# EAGLE design Perc_soundgen (EAGLE 7.1.0)
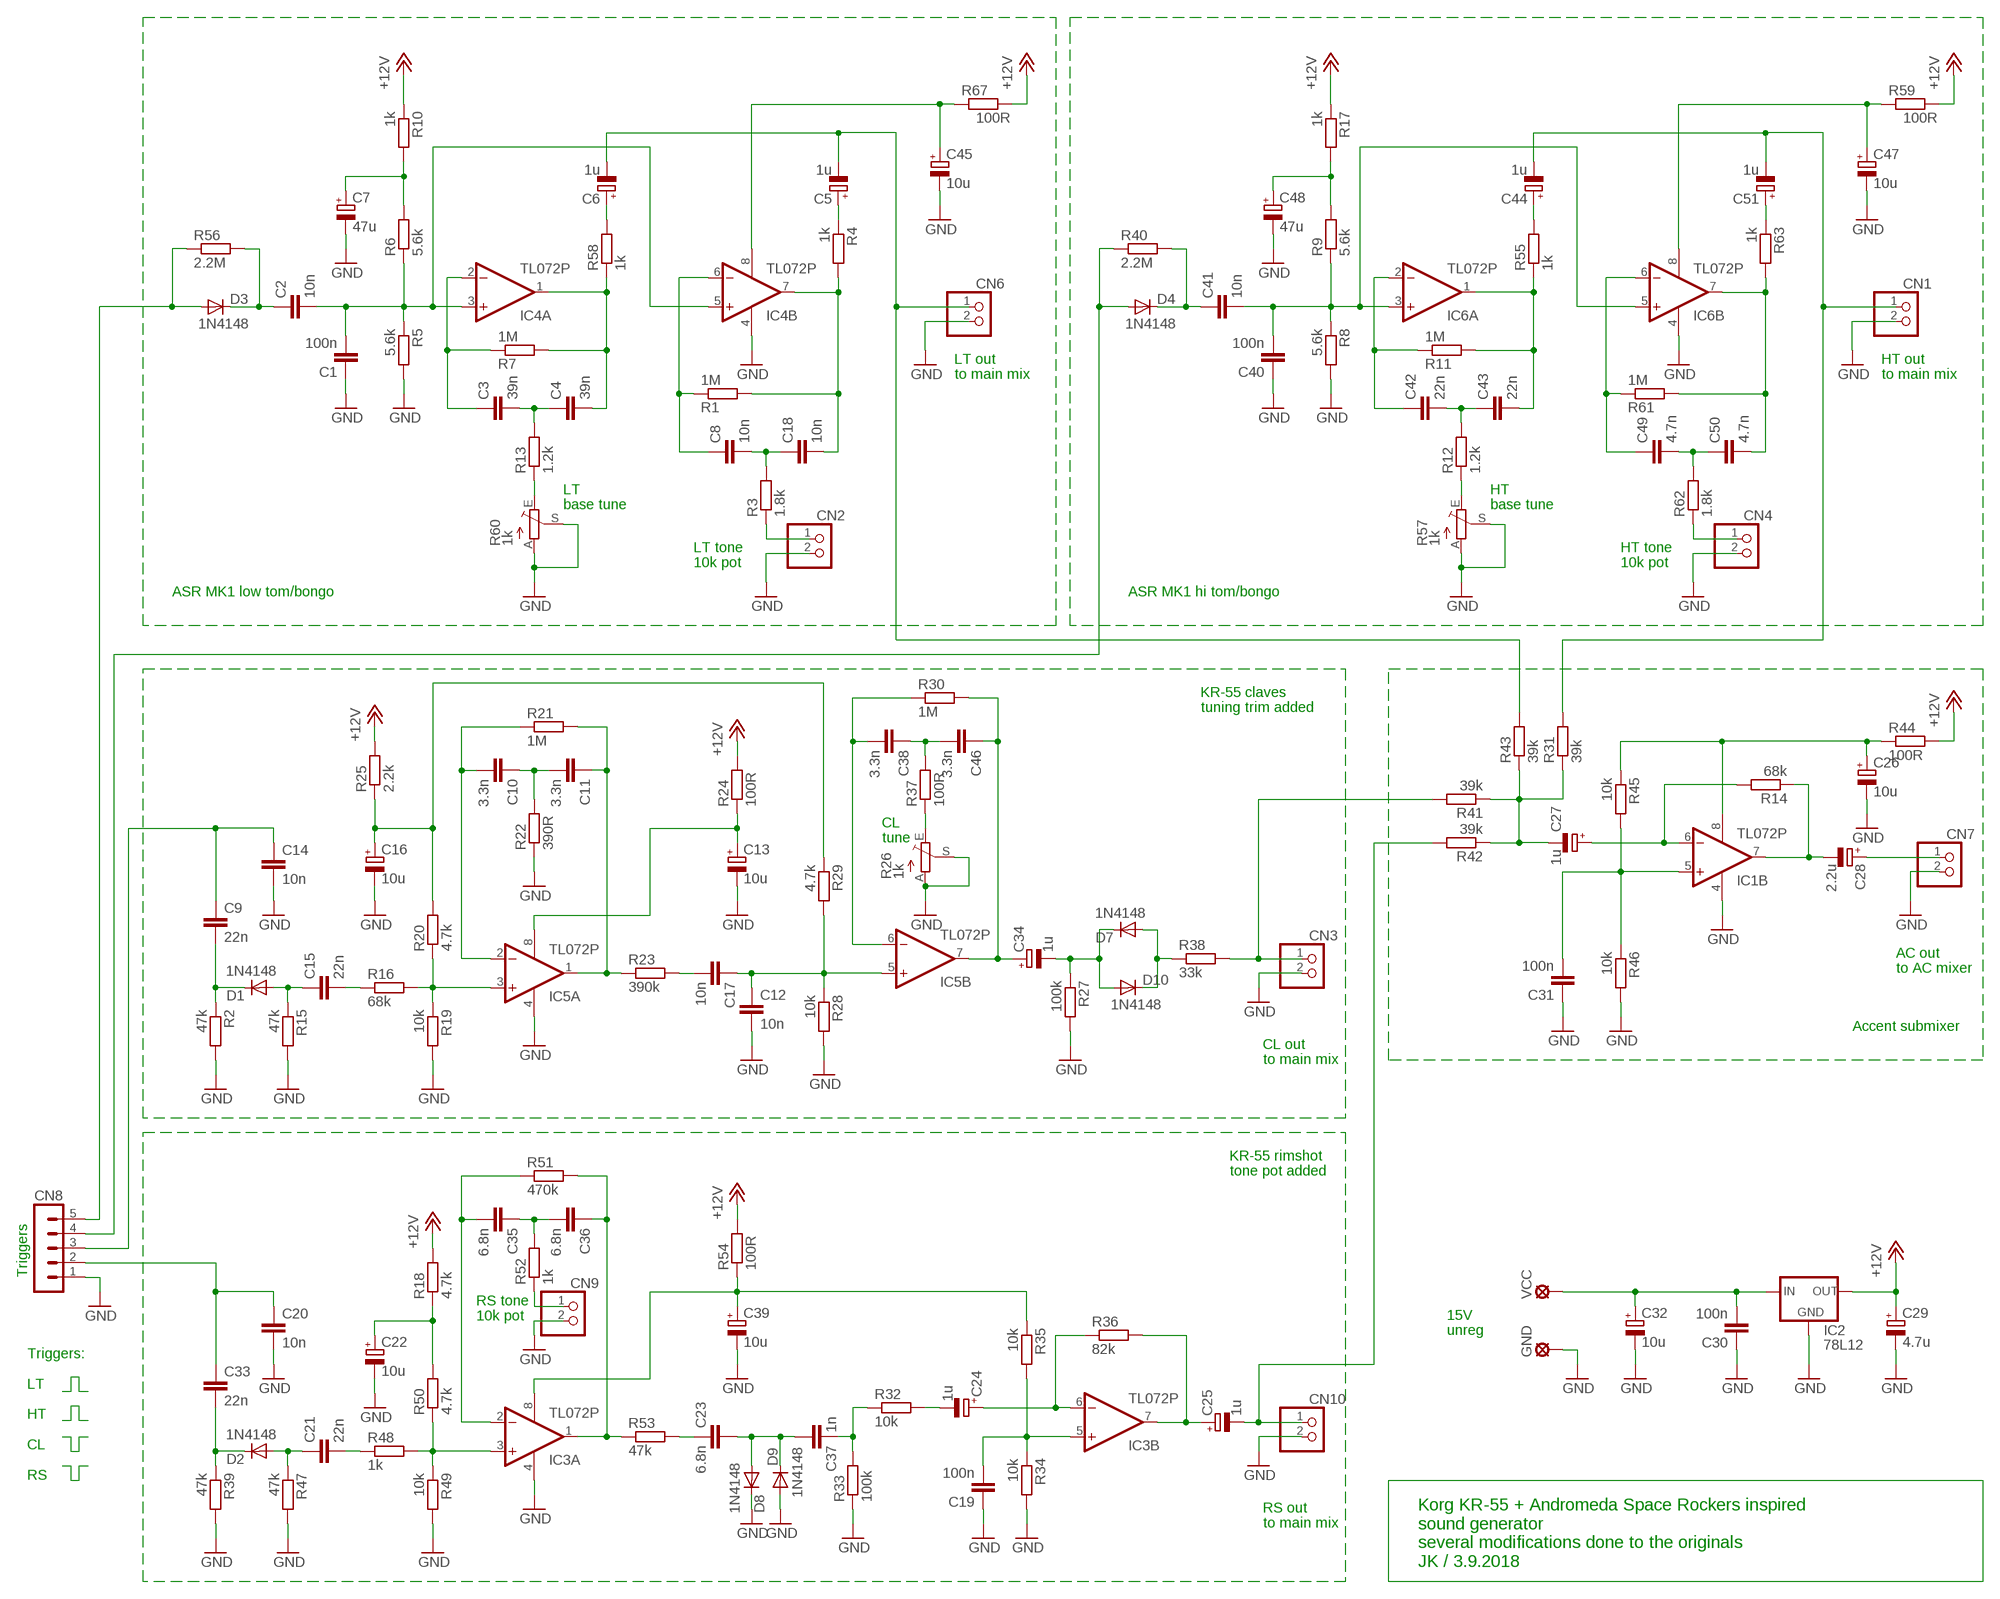
[diagram p0: schematic, sheet 1]

## Parts
C1  100n  C-EUC0805  [C0805]
C2  10n  C-EUC0603  [C0603]
C3  39n  C-EUC0805  [C0805]
C4  39n  C-EUC0805  [C0805]
C5  1u  CPOL-EUSMCA  [SMC_A]
C6  1u  CPOL-EUSMCA  [SMC_A]
C7  47u  CPOL-EUE2.5-5  [E2,5-5]
C8  10n  C-EUC0603  [C0603]
C9  22n  C-EUC0805  [C0805]
C10  3.3n  C-EUC0805  [C0805]
C11  3.3n  C-EUC0805  [C0805]
C12  10n  C-EUC0603  [C0603]
C13  10u  CPOL-EUE2.5-5  [E2,5-5]
C14  10n  C-EUC0603  [C0603]
C15  22n  C-EUC0805  [C0805]
C16  10u  CPOL-EUE2.5-5  [E2,5-5]
C17  10n  C-EUC0603  [C0603]
C18  10n  C-EUC0603  [C0603]
C19  100n  C-EUC0805  [C0805]
C20  10n  C-EUC0603  [C0603]
C21  22n  C-EUC0805  [C0805]
C22  10u  CPOL-EUE2.5-5  [E2,5-5]
C23  6.8n  C-EUC0805  [C0805]
C24  1u  CPOL-EUSMCA  [SMC_A]
C25  1u  CPOL-EUSMCA  [SMC_A]
C26  10u  CPOL-EUE2.5-5  [E2,5-5]
C27  1u  CPOL-EUSMCA  [SMC_A]
C28  2.2u  CPOL-EUSMCA  [SMC_A]
C29  4.7u  CPOL-EUSMCA  [SMC_A]
C30  100n  C-EUC0805  [C0805]
C31  100n  C-EUC0805  [C0805]
C32  10u  CPOL-EUE2.5-5  [E2,5-5]
C33  22n  C-EU075-032X103  [C075-032X103]
C34  1u  CPOL-EUSMCA  [SMC_A]
C35  6.8n  C-EUC0805  [C0805]
C36  6.8n  C-EUC0805  [C0805]
C37  1n  C-EUC0805  [C0805]
C38  3.3n  C-EUC0805  [C0805]
C39  10u  CPOL-EUE2.5-5  [E2,5-5]
C40  100n  C-EUC0805  [C0805]
C41  10n  C-EUC0603  [C0603]
C42  22n  C-EUC0805  [C0805]
C43  22n  C-EUC0805  [C0805]
C44  1u  CPOL-EUSMCA  [SMC_A]
C45  10u  CPOL-EUE2.5-5  [E2,5-5]
C46  3.3n  C-EUC0805  [C0805]
C47  10u  CPOL-EUE2.5-5  [E2,5-5]
C48  47u  CPOL-EUE2.5-5  [E2,5-5]
C49  4.7n  C-EUC0805  [C0805]
C50  4.7n  C-EUC0805  [C0805]
C51  1u  CPOL-EUSMCA  [SMC_A]
CN1  PINHD-1X2  [1X02]
CN2  PINHD-1X2  [1X02]
CN3  PINHD-1X2  [1X02]
CN4  PINHD-1X2  [1X02]
CN6  PINHD-1X2  [1X02]
CN7  PINHD-1X2  [1X02]
CN8  MA05-1  [MA05-1]
CN9  PINHD-1X2  [1X02]
CN10  PINHD-1X2  [1X02]
D1  1N4148  DIODE-SOD80C  [SOD80C]
D2  1N4148  DIODE-SOD80C  [SOD80C]
D3  1N4148  DIODE-SOD80C  [SOD80C]
D4  1N4148  DIODE-SOD80C  [SOD80C]
D7  1N4148  DIODE-SOD80C  [SOD80C]
D8  1N4148  DIODE-SOD80C  [SOD80C]
D9  1N4148  DIODE-SOD80C  [SOD80C]
D10  1N4148  DIODE-SOD80C  [SOD80C]
GND  LSP10  [LSP10]
IC1  TL072P  [DIL08]
IC2  78L12  78LXX  [78LXX]
IC3  TL072P  [DIL08]
IC4  TL072P  [DIL08]
IC5  TL072P  [DIL08]
IC6  TL072P  [DIL08]
R1  1M  R-EU_R0805  [R0805]
R2  47k  R-EU_R0805  [R0805]
R3  1.8k  R-EU_R0805  [R0805]
R4  1k  R-EU_0207/10  [0207/10]
R5  5.6k  R-EU_R0805  [R0805]
R6  5.6k  R-EU_R0805  [R0805]
R7  1M  R-EU_R0805  [R0805]
R8  5.6k  R-EU_R0805  [R0805]
R9  5.6k  R-EU_R0805  [R0805]
R10  1k  R-EU_R0805  [R0805]
R11  1M  R-EU_R0805  [R0805]
R12  1.2k  R-EU_R0805  [R0805]
R13  1.2k  R-EU_0207/12  [0207/12]
R14  68k  R-EU_R0805  [R0805]
R15  47k  R-EU_R0805  [R0805]
R16  68k  R-EU_R0805  [R0805]
R17  1k  R-EU_R0805  [R0805]
R18  4.7k  R-EU_0207/10  [0207/10]
R19  10k  R-EU_R0805  [R0805]
R20  4.7k  R-EU_R0805  [R0805]
R21  1M  R-EU_R0805  [R0805]
R22  390R  R-EU_R1206  [R1206]
R23  390k  R-EU_0207/10  [0207/10]
R24  100R  R-EU_R0805  [R0805]
R25  2.2k  R-EU_R0805  [R0805]
R26  1k  TRIM_EU-S63X  [S63X]
R27  100k  R-EU_R0805  [R0805]
R28  10k  R-EU_R0805  [R0805]
R29  4.7k  R-EU_0207/10  [0207/10]
R30  1M  R-EU_R0805  [R0805]
R31  39k  R-EU_R0805  [R0805]
R32  10k  R-EU_R0805  [R0805]
R33  100k  R-EU_R0805  [R0805]
R34  10k  R-EU_R0805  [R0805]
R35  10k  R-EU_R0805  [R0805]
R36  82k  R-EU_R0805  [R0805]
R37  100R  R-EU_R0805  [R0805]
R38  33k  R-EU_R0805  [R0805]
R39  47k  R-EU_R0805  [R0805]
R40  2.2M  R-EU_R0805  [R0805]
R41  39k  R-EU_R0805  [R0805]
R42  39k  R-EU_R0805  [R0805]
R43  39k  R-EU_R0805  [R0805]
R44  100R  R-EU_R0805  [R0805]
R45  10k  R-EU_R0805  [R0805]
R46  10k  R-EU_R0805  [R0805]
R47  47k  R-EU_R0805  [R0805]
R48  1k  R-EU_R0805  [R0805]
R49  10k  R-EU_R0805  [R0805]
R50  4.7k  R-EU_R0805  [R0805]
R51  470k  R-EU_R0805  [R0805]
R52  1k  R-EU_R0805  [R0805]
R53  47k  R-EU_0207/10  [0207/10]
R54  100R  R-EU_R0805  [R0805]
R55  1k  R-EU_0207/10  [0207/10]
R56  2.2M  R-EU_R0805  [R0805]
R57  1k  TRIM_EU-S63X  [S63X]
R58  1k  R-EU_0207/10  [0207/10]
R59  100R  R-EU_R0805  [R0805]
R60  1k  TRIM_EU-S63X  [S63X]
R61  1M  R-EU_R0805  [R0805]
R62  1.8k  R-EU_R0805  [R0805]
R63  1k  R-EU_0207/10  [0207/10]
R67  100R  R-EU_R0805  [R0805]
VCC  LSP10  [LSP10]

## Nets
+12V: C29.+ IC2.OUT R10.1 R17.1 R18.2 R24.2 R25.2 R44.2 R54.2 R59.2 R67.2
+15V: C30.2 C32.+ IC2.IN VCC.MP
GND: C1.1 C7.- C12.2 C13.- C14.2 C16.- C19.1 C20.2 C22.- C26.- C29.- C30.1 C31.1 C32.- C39.- C40.1 C45.- C47.- C48.- CN1.2 CN2.2 CN3.2 CN4.2 CN6.2 CN7.2 CN8.1 CN9.2 CN10.2 D8.C D9.A GND.MP IC1.4(P:V-) IC2.GND IC3.4(P:V-) IC4.4(P:V-) IC5.4(P:V-) IC6.4(P:V-) R2.2 R5.2 R8.2 R15.2 R19.2 R22.1 R26.A R26.S R27.2 R28.2 R33.1 R34.2 R39.2 R46.2 R47.2 R49.2 R57.A R57.S R60.A R60.S
N$2: C3.1 IC4.2(A:-IN) R7.1
N$3: C4.2 IC4.1(A:OUT) R7.2 R58.1
N$4: C1.2 C2.2 IC4.3(A:+IN) IC4.5(B:+IN) R5.1 R6.1
N$5: C6.+ R58.2
N$6: C7.+ R6.2 R10.2
N$7: C18.2 IC4.7(B:OUT) R1.2 R4.2
N$9: R13.1 R60.E
N$10: C10.2 IC5.2(A:-IN) R21.1
N$11: C2.1 D3.C R56.2
N$12: C23.2 R53.2
N$13: CN2.1 R3.1
N$14: C11.1 IC5.1(A:OUT) R21.2 R23.1
N$15: C10.1 C11.2 R22.2
N$17: R26.E R37.1
N$18: IC5.3(A:+IN) R16.2 R19.1 R20.1
N$19: C15.2 R16.1
N$20: C15.1 D1.A R15.1
N$21: C9.2 D1.C R2.1
N$23: C16.+ R20.2 R25.1 R29.1
N$24: C38.2 IC5.6(B:-IN) R30.1
N$25: C8.1 IC4.6(B:-IN) R1.1
N$26: C35.2 IC3.2(A:-IN) R51.1
N$27: C12.1 C17.1 IC5.5(B:+IN) R28.1 R29.2
N$28: C34.- D7.C D10.A R27.1
N$29: C34.+ C46.1 IC5.7(B:OUT) R30.2
N$30: C8.2 C18.1 R3.2
N$31: C17.2 R23.2
N$34: C24.+ IC3.6(B:-IN) R36.1
N$36: C22.+ R18.1 R50.2
N$37: C24.- R32.2
N$38: C19.2 IC3.5(B:+IN) R34.1 R35.2
N$39: D7.A D10.C R38.1
N$40: C37.1 R32.1 R33.2
N$41: C27.- R31.1 R41.1 R42.1 R43.1
N$42: C28.- IC1.7(B:OUT) R14.1
N$43: C27.+ IC1.6(B:-IN) R14.2
N$45: C23.1 C37.2 D8.A D9.C
N$50: C36.1 IC3.1(A:OUT) R51.2 R53.1
N$51: C35.1 C36.2 R52.2
N$52: CN9.1 R52.1
N$53: IC3.3(A:+IN) R48.2 R49.1 R50.1
N$54: C21.2 R48.1
N$55: C21.1 D2.A R47.1
N$56: C33.2 D2.C R39.1
N$57: C38.1 C46.2 R37.2
N$58: C25.+ IC3.7(B:OUT) R36.2
N$59: C3.2 C4.1 R13.2
N$60: C5.+ R4.1
N$61: C43.2 IC6.1(A:OUT) R11.2 R55.1
N$62: C40.2 C41.2 IC6.3(A:+IN) IC6.5(B:+IN) R8.1 R9.1
N$63: C42.1 IC6.2(A:-IN) R11.1
N$64: C42.2 C43.1 R12.2
N$65: C47.+ IC6.8(P:V+) R59.1
N$66: C48.+ R9.2 R17.2
N$67: C41.1 D4.C R40.2
N$69: C50.2 IC6.7(B:OUT) R61.2 R63.2
N$70: CN4.1 R62.1
N$71: C49.1 IC6.6(B:-IN) R61.1
N$72: C49.2 C50.1 R62.2
N$73: R12.1 R57.E
N$74: C45.+ IC4.8(P:V+) R67.1
N$75: C44.+ R55.2
N$76: C51.+ R63.1
OUT_AC: C28.+ CN7.1
OUT_CL: CN3.1 R38.2 R41.2
OUT_HT: C44.- C51.- CN1.1 R31.2
OUT_LT: C5.- C6.- CN6.1 R43.2
OUT_RS: C25.- CN10.1 R42.2
TRIG_CL: C9.1 C14.1 CN8.3
TRIG_HT: CN8.4 D4.A R40.1
TRIG_LT: CN8.5 D3.A R56.1
TRIG_RS: C20.1 C33.1 CN8.2
V_BD: C39.+ IC3.8(P:V+) R35.1 R54.1
V_BD1: C13.+ IC5.8(P:V+) R24.1
V_MX: C26.+ IC1.8(P:V+) R44.1 R45.1
V_MX/2: C31.2 IC1.5(B:+IN) R45.2 R46.1
Unconnected: IC1.1(A:OUT) IC1.2(A:-IN) IC1.3(A:+IN)

## Notes on the sheet
- LT out
  to main mix
- HT out
  to main mix
- LT
  base tune
- HT
  base tune
- LT tone
  10k pot
- HT tone
  10k pot
- ASR MK1 low tom/bongo | ASR MK1 hi tom/bongo
- KR-55 claves
  tuning trim added
- CL
  tune
- AC out
  to AC mixer
- Accent submixer
- CL out
  to main mix
- KR-55 rimshot
  tone pot added
- Triggers
- RS tone
  10k pot
- 15V
  unreg
- Triggers:
  
  LT
  
  HT
  
  CL
  
  RS
- RS out
  to main mix
- Korg KR-55 + Andromeda Space Rockers inspired
  sound generator
  several modifications done to the originals
  JK / 3.9.2018

## Library data of the parts
C1-C4 C8-C12 C14 C15 C17-C21 C23 C30 C31 C33 C35-C38 C40-C43 C46 C49 C50 = rcl:C-EU: CAPACITOR, European symbol
C5-C7 C13 C16 C22 C24-C29 C32 C34 C39 C44 C45 C47 C48 C51 = rcl:CPOL-EU: POLARIZED CAPACITOR, European symbol
CN1-CN4 CN6 CN7 CN9 CN10 = pinhead:PINHD-1X2: PIN HEADER
CN8 = con-lstb:MA05-1: PIN HEADER; OC_FARNELL: unknown; OC_NEWARK: unknown
D1-D4 D7-D10 = diode:DIODE-: DIODE
GND VCC = solpad:LSP10: SOLDER PAD drill 1.0 mm, distributor Buerklin, 12H555
IC1 IC3-IC6 = linear:TL072: OP AMP
IC2 = v-reg:78LXX: VOLTAGE REGULATOR
R1-R25 R27-R56 R58 R59 R61-R63 R67 = rcl:R-EU_: RESISTOR, European symbol
R26 R57 R60 = pot:TRIM_EU-: POTENTIOMETER

## Board
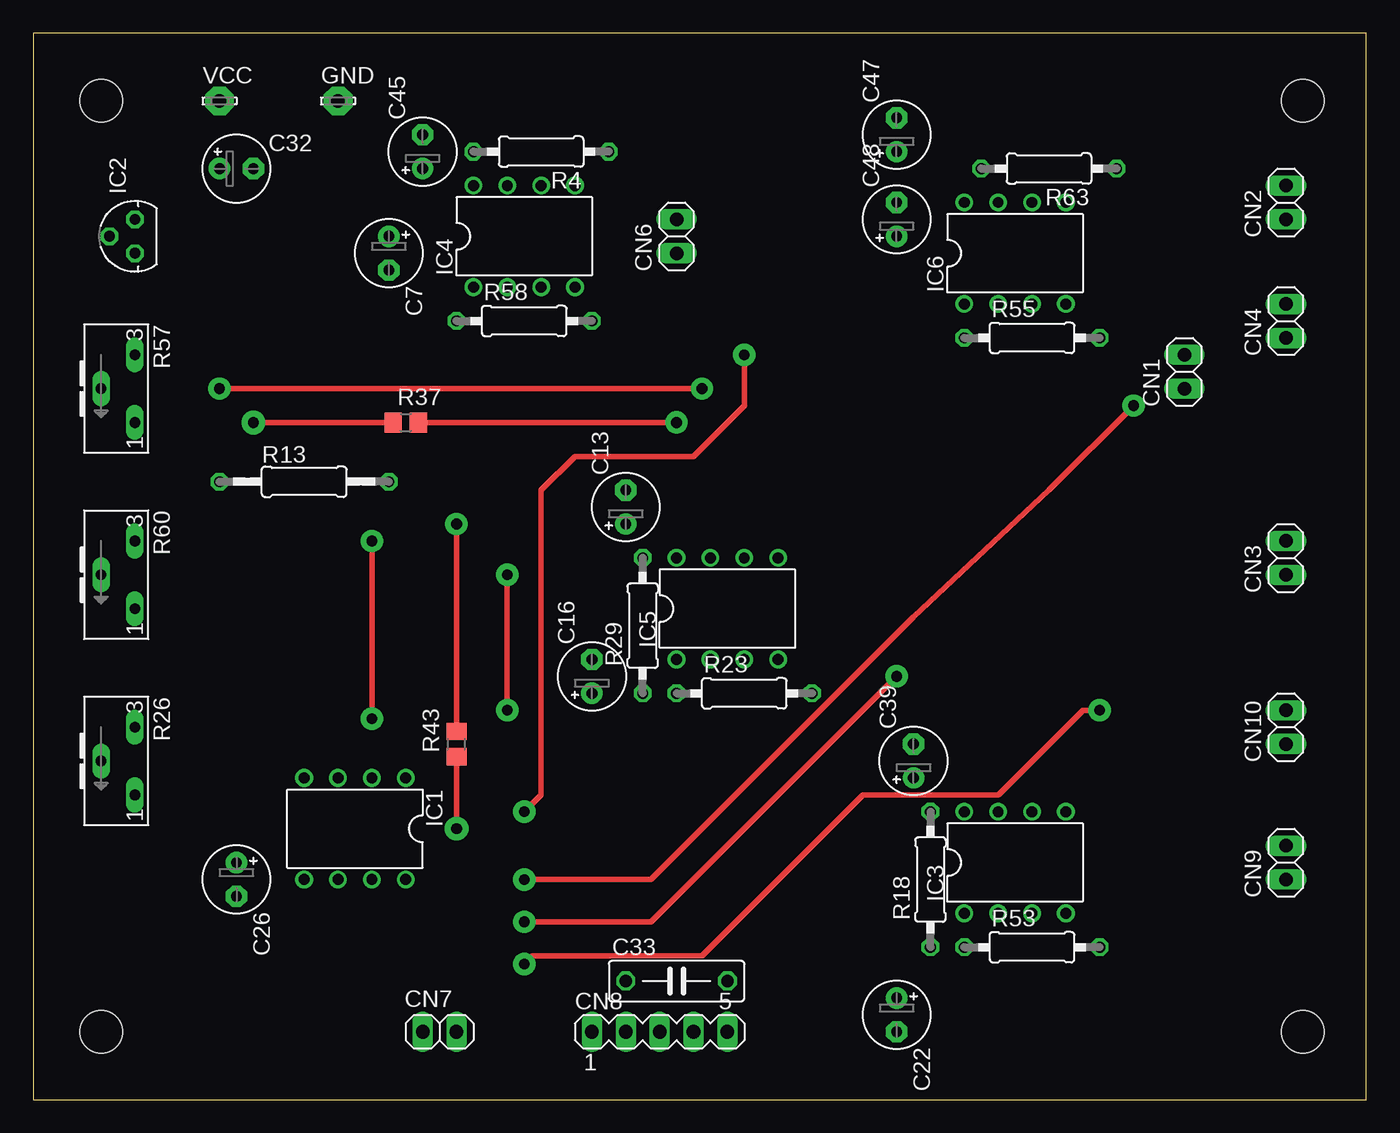
[diagram p1: board, top side]
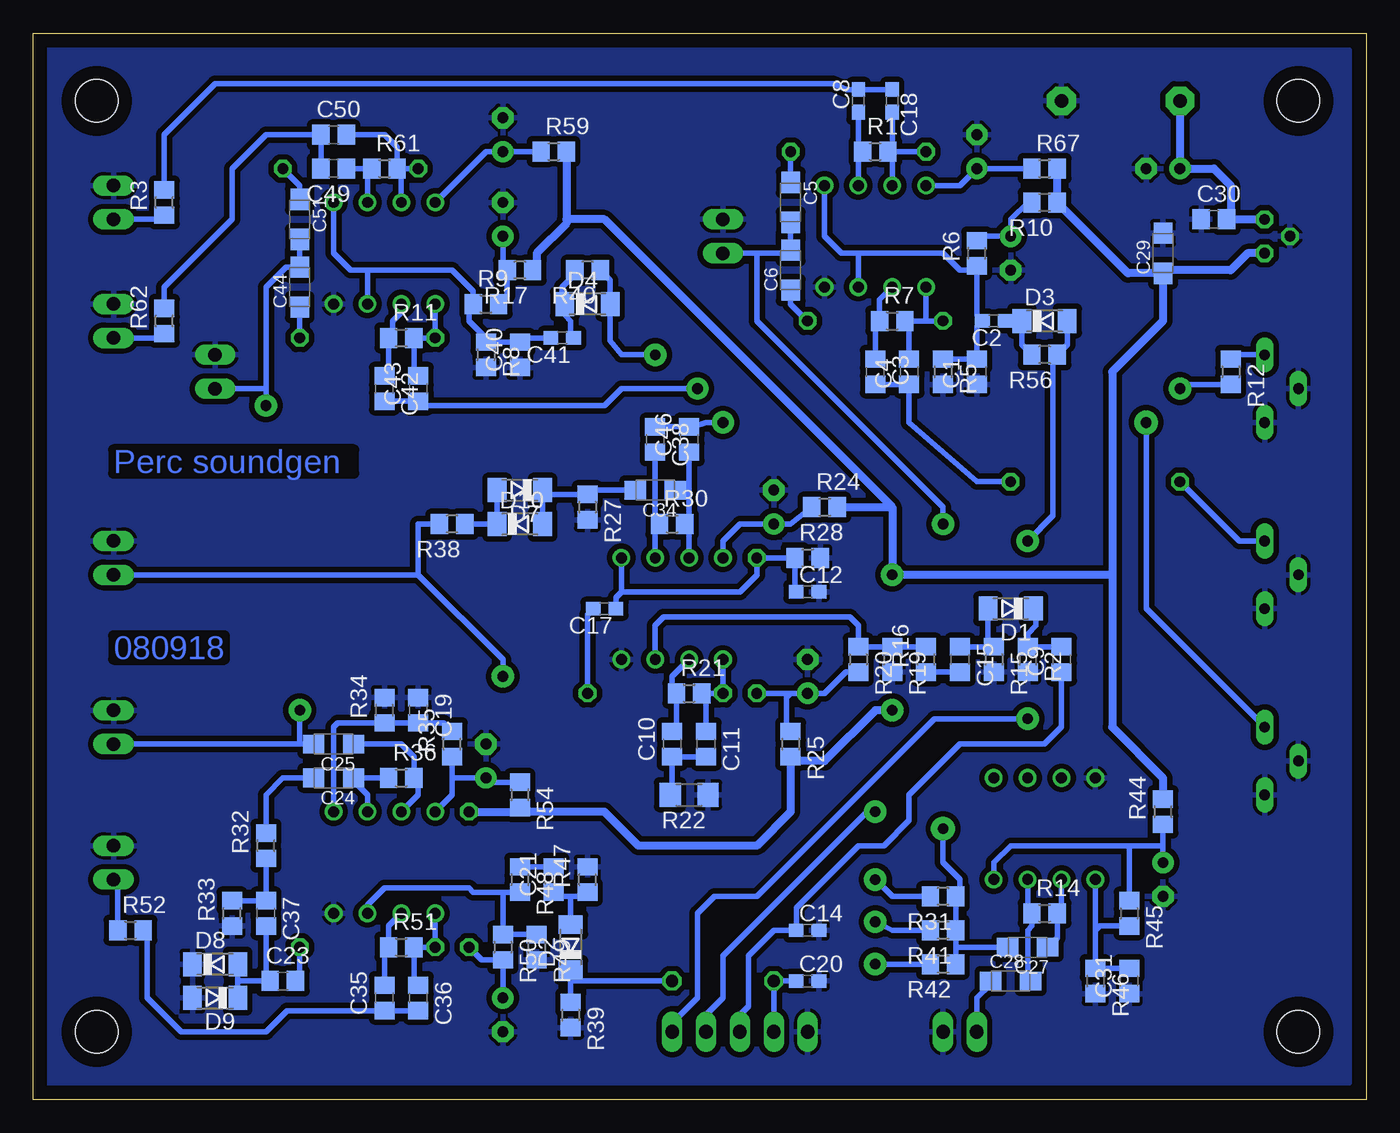
[diagram p2: board, bottom side, seen from below]

Size 100 x 80 mm. Coordinates in mm from the lower left corner, seen from the top.
Outline: 0,0 100,0 100,80 0,80 0,0
Copper layers (1*16): Top 0.035mm / dielectric 1.5mm / Bottom 0.035mm
Design rules "default": minimum track width 10mil, minimum drill 24mil, track to track 8mil, track to pad 8mil, pad to pad 8mil, via to via 8mil, smd to smd 8mil, copper to edge 40mil, drill to drill 8mil, minimum pad ring 10mil, minimum via ring 8mil, stop-mask expansion 4mil, vias tented up to drill 0mil, thermal gap 10mil
Holes 3.2 mm at 5.08,74.93 95.25,74.93 5.08,5.08 95.25,5.08

### Footprints (pad centres in the part's own frame; a part is rotated, then mirrored left to right if it is on the bottom)
C0805 = smd 1.3 x 1.5: 1 -0.95,0; 2 0.95,0
C0603 = smd 1.1 x 1: 1 -0.85,0; 2 0.85,0
SMC_A = smd 1.6 x 1.4: + -1.5,0; - 1.5,0
E2,5-5 = drill 0.813 pad 1.6: + -1.27,0 | drill 0.813 pad 1.6 octagon: - 1.27,0
C075-032X103 = drill 0.914 octagon: 1 -3.81,0; 2 3.81,0
1X02 = drill 1.016 long: 1 -1.27,0; 2 1.27,0
MA05-1 = drill 1.016 long: 1 -5.08,0; 2 -2.54,0; 3 0,0; 4 2.54,0; 5 5.08,0
SOD80C = smd 1.4 x 1.8: A 1.7,0; C -1.7,0
LSP10 = drill 1.016 pad 2.159 octagon: MP 0,0
DIL08 = drill 0.813 pad 1.27: 1 -3.81,-3.81; 2 -1.27,-3.81; 3 1.27,-3.81; 4 3.81,-3.81; 5 3.81,3.81; 6 1.27,3.81; 7 -1.27,3.81; 8 -3.81,3.81
78LXX = drill 0.813 octagon: GND 0,1.905; IN 1.27,0; OUT -1.27,0
R0805 = smd 1.3 x 1.5: 1 -0.95,0; 2 0.95,0
0207/10 = drill 0.813 octagon: 1 -5.08,0; 2 5.08,0
0207/12 = drill 0.813 octagon: 1 -6.35,0; 2 6.35,0
R1206 = smd 1.6 x 1.803: 1 -1.422,0; 2 1.422,0
S63X = drill 0.813 long: A 2.54,0; E -2.54,0; S 0,-2.54

### Placement (x,y rotation side)
C1  29.21,54.61 90 bottom
C2  27.94,58.42 180 bottom
C3  36.83,54.61 270 bottom
C4  34.29,54.61 90 bottom
C5  43.18,67.31 270 bottom
C6  43.18,62.23 90 bottom
C7  26.67,63.5 270 top
C8  38.1,74.93 90 bottom
C9  22.86,33.02 90 bottom
C10  52.07,26.67 90 bottom
C11  49.53,26.67 270 bottom
C12  41.91,38.1 0 bottom
C13  44.45,44.45 90 top
C14  41.91,12.7 0 bottom
C15  30.48,33.02 270 bottom
C16  41.91,31.75 90 top
C17  57.15,36.83 180 bottom
C18  35.56,74.93 270 bottom
C19  71.12,29.21 270 bottom
C20  41.91,8.89 0 bottom
C21  60.96,16.51 90 bottom
C22  64.77,6.35 270 top
C23  81.28,8.89 0 bottom
C24  77.47,24.13 180 bottom
C25  77.47,26.67 180 bottom
C26  15.24,16.51 270 top
C27  25.4,11.43 180 bottom
C28  26.67,8.89 0 bottom
C29  15.24,63.5 90 bottom
C30  11.43,66.04 0 bottom
C31  17.78,8.89 90 bottom
C32  15.24,69.85 0 top
C33  48.26,8.89 0 top
C34  53.34,45.72 180 bottom
C35  73.66,7.62 90 bottom
C36  71.12,7.62 270 bottom
C37  82.55,13.97 270 bottom
C38  53.34,49.53 270 bottom
C39  66.04,25.4 90 top
C40  63.5,55.88 90 bottom
C41  60.33,57.15 180 bottom
C42  73.66,53.34 270 bottom
C43  71.12,53.34 90 bottom
C44  80.01,60.96 90 bottom
C45  29.21,71.12 90 top
C46  50.8,49.53 90 bottom
C47  64.77,72.39 90 top
C48  64.77,66.04 90 top
C49  77.47,69.85 180 bottom
C50  77.47,72.39 0 bottom
C51  80.01,66.04 270 bottom
CN1  86.36,54.61 90 top
CN2  93.98,67.31 90 top
CN3  93.98,40.64 90 top
CN4  93.98,58.42 90 top
CN6  48.26,64.77 90 top
CN7  30.48,5.08 0 top
CN8  46.99,5.08 0 top
CN9  93.98,17.78 90 top
CN10  93.98,27.94 90 top
D1  26.67,36.83 180 bottom
D2  59.69,11.43 90 bottom
D3  24.13,58.42 0 bottom
D4  58.42,59.69 0 bottom
D7  63.5,45.72 180 bottom
D8  86.36,10.16 0 bottom
D9  86.36,7.62 180 bottom
D10  63.5,43.18 0 bottom
GND  22.86,74.93 0 top
IC1  24.13,20.32 180 top
IC2  7.62,64.77 90 top
IC3  73.66,17.78 0 top
IC4  36.83,64.77 0 top
IC5  52.07,36.83 0 top
IC6  73.66,63.5 0 top
R1  36.83,71.12 0 bottom
R2  25.4,33.02 270 bottom
R3  90.17,67.31 90 bottom
R4  38.1,71.12 180 top
R5  31.75,54.61 270 bottom
R6  29.21,63.5 90 bottom
R7  35.56,58.42 0 bottom
R8  66.04,55.88 270 bottom
R9  66.04,59.69 0 bottom
R10  24.13,67.31 180 bottom
R11  72.39,57.15 0 bottom
R12  10.16,54.61 270 bottom
R13  20.32,46.35 0 top
R14  24.13,13.97 0 bottom
R15  27.94,33.02 270 bottom
R16  33.02,33.02 90 bottom
R17  63.5,62.23 180 bottom
R18  67.31,16.51 90 top
R19  35.56,33.02 270 bottom
R20  38.1,33.02 270 bottom
R21  50.8,30.48 0 bottom
R22  50.8,22.86 180 bottom
R23  53.34,30.48 0 top
R24  40.64,44.45 0 bottom
R25  43.18,26.67 270 bottom
R26  7.62,25.4 270 top
R27  58.42,44.45 270 bottom
R28  41.91,40.64 0 bottom
R29  45.72,35.56 90 top
R30  52.07,43.18 0 bottom
R31  31.75,15.24 180 bottom
R32  82.55,19.05 90 bottom
R33  85.09,13.97 90 bottom
R34  73.66,29.21 90 bottom
R35  68.58,26.67 90 bottom
R36  72.39,24.13 0 bottom
R37  27.94,50.8 0 top
R38  68.58,43.18 180 bottom
R39  59.69,6.35 270 bottom
R40  58.42,62.23 180 bottom
R41  31.75,12.7 180 bottom
R42  31.75,10.16 180 bottom
R43  31.75,26.67 90 top
R44  15.24,21.59 90 bottom
R45  17.78,13.97 270 bottom
R46  20.32,8.89 270 bottom
R47  58.42,16.51 90 bottom
R48  63.5,16.51 270 bottom
R49  62.23,11.43 270 bottom
R50  64.77,11.43 270 bottom
R51  72.39,11.43 0 bottom
R52  92.71,12.7 0 bottom
R53  74.93,11.43 0 top
R54  63.5,22.86 270 bottom
R55  74.93,57.15 0 top
R56  24.13,55.88 180 bottom
R57  7.62,53.34 270 top
R58  36.83,58.42 0 top
R59  60.96,71.12 0 bottom
R60  7.62,39.37 270 top
R61  73.66,69.85 0 bottom
R62  90.17,58.42 90 bottom
R63  76.2,69.85 180 top
R67  24.13,69.85 0 bottom
VCC  13.97,74.93 0 top

### Tracks (layer width: path | path; a pad name or v marks a point on that pad's centre or on a via)
+12V  (via drill 0.8 pad 1.68)
  Top 0.406: v35.56,39.37 v35.56,29.21
  Bottom 0.406: 63.82,21.59 R54.2
  Bottom 0.61: R18.2 63.82,21.59 | IC2.OUT 8.89,63.5 10.16,62.23 15.01,62.23 C29.+ | C29.+ 17.87,62 R10.1 R67.2 | C29.+ 15.24,58.42 19.05,54.61 19.05,39.37 | R59.2 60.01,66.04 | 60.01,66.04 60.01,65.72 62.23,63.5 62.23,62.55 R17.1 | 19.05,39.37 19.05,27.94 15.24,24.13 R44.2 | 35.56,44.45 v35.56,39.37 19.05,39.37 | v35.56,29.21 36.83,29.21 40.64,25.4 42.86,25.4 R25.2 43.18,21.59 45.72,19.05 54.61,19.05 57.15,21.59 63.18,21.59 R54.2 | R24.2 35.56,44.45 | 35.56,44.45 57.15,66.04 60.01,66.04
+15V
  Bottom 0.61: VCC.MP C32.+ 11.43,69.85 10.16,68.58 10.16,66.36 C30.2 IC2.IN
GND
  pour Bottom (isolate 0.406): 1.27,78.74 99.06,78.74 99.06,1.27 1.27,1.27
N$2
  Bottom 0.406: C3.1 36.83,58.1 R7.1 36.51,60.01 IC4.2
N$3
  Bottom 0.406: R58.1 33.02,58.42 | 33.02,58.42 R7.2 34.29,58.1 C4.2 | IC4.1 33.02,58.42
N$4
  Bottom 0.406: R5.1 C1.2 29.21,58 C2.2 29.21,58.84 29.21,62.23 | R6.1 29.21,62.23 | 29.21,62.23 30.48,62.23 31.75,63.5 38.1,63.5 | 38.1,63.5 39.37,63.5 40.64,64.77 IC4.5 | IC4.3 38.1,63.5
N$5
  Bottom 0.406: R58.2 43.18,59.69 C6.+
N$6
  Bottom 0.406: R10.2 25.4,67.31 26.67,66.04 C7.+ 28.89,64.77 R6.2
N$7
  Bottom 0.406: IC4.7 35.56,70.8 R1.2 | C18.2 35.56,71.44 R1.2 | R4.2 R1.2
N$9
  Bottom 0.406: R60.E 9.53,41.91 R13.1
N$10
  Bottom 0.406: IC5.2 52.07,31.75 52.07,30.8 R21.1 51.75,27.94 C10.2
N$11
  Bottom 0.406: R56.2 25.83,56.63 D3.C C2.1
N$12
  Bottom 0.406: R53.2 80.01,9.21 C23.2
N$13
  Bottom 0.406: CN2.1 90.49,66.04 R3.1
N$14
  Bottom 0.406: IC5.1 R23.1 R21.2 49.53,30.16 C11.1
N$15
  Bottom 0.406: C11.2 C10.1 52.07,23.01 R22.2
N$17  (via drill 0.8 pad 1.78)
  Top 0.406: R37.1 v16.51,50.8
  Bottom 0.406: v16.51,50.8 16.51,36.83 R26.E
N$18
  Bottom 0.406: R16.2 R19.1 R20.1 38.1,35.56 38.73,36.2 52.7,36.2 53.34,35.56 IC5.3
N$19
  Bottom 0.406: C15.2 R16.1
N$20
  Bottom 0.406: D1.A 28.37,34.4 R15.1 C15.1
N$21
  Bottom 0.406: C9.2 R2.1 25.4,34.92 24.77,35.56 24.77,36.62 D1.C
N$23
  Bottom 0.406: R20.2 39.05,32.07 40.64,30.48 C16.+ 43.18,30.48 | 43.18,30.48 R29.1 | 43.5,27.94 43.5,30.16 43.18,30.48
  Bottom 0.61: 43.5,27.94 R25.1
N$24
  Bottom 0.406: IC5.6 53.34,42.86 R30.1 53.34,43.5 C38.2 53.02,48.26
N$25
  Bottom 0.406: IC4.6 38.1,70.8 R1.1 38.1,71.44 C8.1
N$26
  Bottom 0.406: C35.2 73.66,11.11 R51.1 73.34,13.02 IC3.2
N$27
  Bottom 0.406: C12.1 42.86,38.2 R28.1 R29.2 45.72,39.37 46.99,38.1 55.88,38.1 | 55.88,38.1 IC5.5 | C17.1 56.3,37.68 55.88,38.1
N$28
  Bottom 0.406: 58.33,45.49 R27.1 | R27.1 61.48,45.4 D7.C D10.A | C34.- 58.1,45.72 R27.1
N$29
  Bottom 0.406: IC5.7 50.8,42.86 R30.2 50.8,43.5 50.8,45.72 | 51.84,45.95 C34.+ 50.8,45.72 | C46.1 50.8,45.72
N$30
  Bottom 0.406: C18.1 C8.2 38.95,75.78 40.01,76.2 86.36,76.2 90.17,72.39 R3.2
N$31
  Bottom 0.406: R23.2 58.42,36.41 C17.2
N$34
  Bottom 0.406: R36.1 C24.+ 75.97,23.9 74.93,22.86 IC3.6
N$36
  Bottom 0.406: C22.+ R50.2 66.36,10.48 R18.1
N$37
  Bottom 0.406: R32.2 82.55,22.86 81.28,24.13 C24.-
N$38
  Bottom 0.406: R35.2 69.21,28.25 C19.2 R34.1 77.15,28.26 77.47,27.94 IC3.5
N$39
  Bottom 0.406: D7.A D10.C R38.1
N$40
  Bottom 0.406: R33.2 C37.1 R32.1
N$41  (via drill 0.8 pad 1.78)
  Top 0.406: R43.1 v31.75,20.32
  Bottom 0.406: R42.1 30.8,11.43 | 30.8,11.43 R41.1 R31.1 30.48,15.56 30.48,16.51 31.75,17.78 v31.75,20.32 | C27.- 30.8,11.43
N$42
  Bottom 0.406: IC1.7 25.4,14.29 R14.1 25.08,13.02 25.4,12.7 25.4,9.12 C28.-
N$43
  Bottom 0.406: IC1.6 22.86,14.29 R14.2 23.18,12.15 C27.+
N$45
  Bottom 0.406: D9.C 84.66,8.89 | 84.66,8.89 D8.A | 84.66,8.89 C23.1 82.55,9.21 C37.2
N$50
  Bottom 0.406: IC3.1 R53.1 R51.2 71.44,8.89 C36.1
N$51
  Bottom 0.406: C36.2 C35.1 80.96,6.67 82.55,5.08 88.9,5.08 91.44,7.62 91.44,12.38 R52.2
N$52
  Bottom 0.406: R52.1 93.66,16.19 CN9.1
N$53
  Bottom 0.406: R49.1 R50.1 64.77,15.56 | R48.2 64.77,15.56 | 64.77,15.56 67,15.56 67.31,15.88 73.66,15.88 74.93,14.61 IC3.3
N$54
  Bottom 0.406: C21.2 R48.1
N$55
  Bottom 0.406: 59.69,15.24 D2.A 59.69,12.7 | 59.69,15.24 58.42,15.24 R47.1 | 59.69,15.24 60.96,15.24 C21.1
N$56
  Bottom 0.406: C33.2 59.69,8.89 | 59.69,8.89 R39.1 | 59.69,8.89 D2.C 59.69,10.16
N$57  (via drill 0.8 pad 1.68)
  Top 0.406: v48.26,50.8 R37.2
  Bottom 0.406: C38.1 C46.2 50.48,50.48 49.53,50.8 v48.26,50.8
N$58
  Bottom 0.406: IC3.7 71.12,22.86 71.12,23.81 R36.2 71.44,25.72 72.39,26.67 C25.+
N$59
  Bottom 0.406: C3.2 C4.1 34.29,50.8 29.21,46.35 R13.2
N$60
  Bottom 0.406: C5.+ R4.1
N$61
  Bottom 0.406: IC6.1 R55.1 R11.2 71.44,54.61 C43.2
N$62
  Bottom 0.406: C41.2 63.18,57.15 C40.2 R8.1 66.04,57.15 67.31,58.42 67.31,59.37 R9.1 66.99,60.64 68.58,62.23 74.93,62.23 | 74.93,62.23 76.2,62.23 77.47,63.5 IC6.5 | IC6.3 74.93,62.23
N$63
  Bottom 0.406: IC6.2 72.39,59.05 73.03,58.42 73.03,57.47 R11.1 73.34,54.61 C42.1
N$64  (via drill 0.8 pad 1.68)
  Top 0.406: v13.97,53.34 v50.16,53.34
  Bottom 0.406: C42.2 C43.1 70.8,52.07 57.15,52.07 55.88,53.34 v50.16,53.34 | R12.2 13.65,53.66 v13.97,53.34
N$65
  Bottom 0.406: R59.1 C47.+ 66.04,71.12 IC6.8
N$66
  Bottom 0.406: C48.+ 64.77,62.55 R17.2 64.45,60.33 R9.2
N$67
  Bottom 0.406: R40.2 59.37,61.91 60.33,60.96 60.33,59.9 D4.C 60.12,58.85 59.69,58.42 59.69,57.37 C41.1
N$69
  Bottom 0.406: IC6.7 72.39,69.53 R61.2 | R63.2 R61.2 | R61.2 72.71,71.44 73.66,72.39 C50.2
N$70
  Bottom 0.406: CN4.1 90.49,57.15 R62.1
N$71
  Bottom 0.406: IC6.6 74.93,69.53 R61.1 C49.1
N$72
  Bottom 0.406: C49.2 C50.1 82.55,72.39 85.09,69.85 85.09,66.04 90.17,60.96 R62.2
N$73
  Bottom 0.406: R57.E 9.84,55.88 R12.1
N$74
  Bottom 0.406: R67.1 C45.+ 30.48,68.58 IC4.8
N$75
  Bottom 0.406: R55.2 C44.+
N$76
  Bottom 0.406: C51.+ 80.01,68.58 R63.1
OUT_AC
  Bottom 0.406: C28.+ 28.17,8.66 29.21,7.62 CN7.1
OUT_CL  (via drill 0.8 pad 1.68)
  Top 0.406: v36.83,13.34 46.35,13.34 v64.77,31.75
  Bottom 0.406: R38.2 71.12,43.18 71.12,39.37 | 71.12,39.37 CN3.1 | R41.2 35.56,12.7 v36.83,13.34 | v64.77,31.75 64.77,33.02 71.12,39.37
OUT_HT  (via drill 0.8 pad 1.68)
  Top 0.406: v36.83,16.51 46.35,16.51 66.04,36.2 76.2,45.72 v82.55,52.07
  Bottom 0.406: C51.- C44.- 81.05,62.46 82.55,60.96 82.55,53.34 | R31.2 35.56,15.24 v36.83,16.51 | 82.55,53.34 v82.55,52.07 | CN1.1 82.55,53.34
OUT_LT  (via drill 0.8 pad 1.68)
  Top 0.406: v31.75,43.18 R43.2
  Bottom 0.406: CN6.1 45.72,63.5 | 45.72,63.5 43.41,63.5 C6.- C5.- | v31.75,43.18 31.75,44.45 45.72,58.42 45.72,63.5
OUT_RS  (via drill 0.8 pad 1.68)
  Top 0.406: v36.83,10.16 37.47,10.79 50.16,10.79 62.23,22.86 72.39,22.86 78.74,29.21 v80.01,29.21
  Bottom 0.406: CN10.1 80.01,26.67 | 80.01,26.67 C25.- | R42.2 v36.83,10.16 | v80.01,29.21 80.01,26.67
TRIG_CL
  Bottom 0.406: CN8.3 46.99,6.35 46.35,6.99 46.35,10.79 44.45,12.7 C14.1 42.76,14.39 38.1,19.05 36.2,19.05 34.29,20.95 34.29,22.86 30.48,26.67 24.13,26.67 22.86,27.94 C9.1
TRIG_HT  (via drill 0.8 pad 1.68)
  Top 0.406: v53.34,55.88 53.34,52.07 49.53,48.26 40.64,48.26 38.1,45.72 38.1,22.86 v36.83,21.59
  Bottom 0.406: R40.1 56.72,61.48 D4.A 56.72,56.95 55.88,55.88 v53.34,55.88 | CN8.4 49.53,6.35 48.26,7.62 48.26,10.79 37.47,21.59 v36.83,21.59
TRIG_LT  (via drill 0.8 pad 1.68)
  Top 0.406: v25.4,28.57 v25.4,41.91
  Bottom 0.406: D3.A 22.43,56.63 R56.1 23.5,55.56 23.5,43.81 v25.4,41.91 | CN8.5 52.07,5.71 50.16,7.62 50.16,13.97 48.9,15.24 45.72,15.24 32.38,28.57 v25.4,28.57
TRIG_RS
  Bottom 0.406: CN8.2 C33.1 C20.1
V_BD
  Bottom 0.406: R54.1 65.72,23.81 C39.+ 68.58,24.13 | 68.58,24.13 R35.1 | IC3.8 68.58,22.86 68.58,24.13
V_BD1
  Bottom 0.406: R24.1 43.18,43.18 C13.+ 46.99,43.18 48.26,41.91 IC5.8
V_MX
  Bottom 0.406: R44.1 15.24,19.05 | 15.24,19.05 C26.+ | IC1.8 27.94,17.78 26.67,19.05 17.78,19.05 | 17.78,19.05 15.24,19.05 | R45.1 17.78,19.05
V_MX/2
  Bottom 0.406: IC1.5 20.32,12.7 | 20.32,12.7 R46.1 C31.2 | R45.2 20,13.02 20.32,12.7

### Text on the board
Bottom: Perc soundgen | 080918